# Altium schematic sheet Power.SchDoc
size 420 x 297 mm; CmpIndex: 75; SymIndex: 30
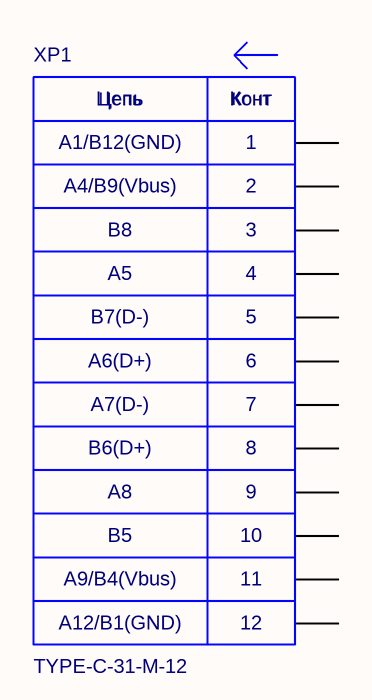
[diagram p0: Power.SchDoc]

## Parts
XP1  TYPE-C-31-M-12

## Nets

Not connected (* = marked no-connect by the designer): XP1 1 2 3 4 5 6 7 8 9 10 11 12

## Notes on the sheet
- Лист
- Изм.
- № Докум.
- Подп.
- Дата
- (in symbol TYPE-C-31-M-12) Цепь; Конт; A1/B12(GND); A4/B9(Vbus); B8; A5; B7(D-); A6(D+); A7(D-); B6(D+); A8; B5; A9/B4(Vbus); A12/B1(GND)

## Library data of the parts
XP1 = TYPE-C-31-M-12: CmpIndex: 40; DXDB_LIBNAME: Connectors USB; Ref Designator: XP1; SymIndex: 44; Orientation: 4 = 4; Part Label: TYPE-C-31-M-12; Part Name: TYPE-C-31-M-12; Part Number NP: TYPE-C-31-M-12; Part Number: TYPE-C-31-M-12